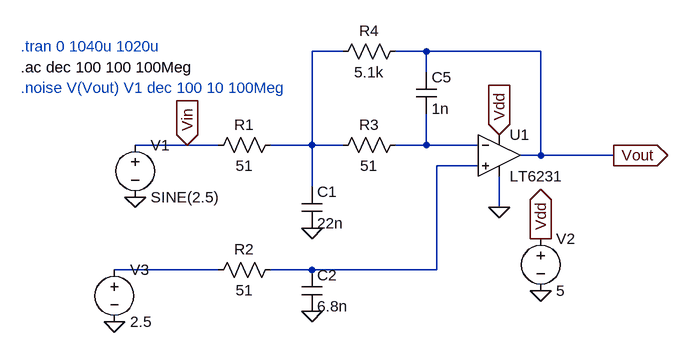
[diagram p0: schematic Multiple feedback low pass amplifier.asc]
Multiple feedback low pass amplifier.asc, the LTspice schematic file:
Version 4
SHEET 1 880 752
WIRE 272 80 224 80
WIRE 400 80 352 80
WIRE 576 80 400 80
WIRE 400 112 400 80
WIRE 32 224 -48 224
WIRE 80 224 32 224
WIRE 224 224 224 80
WIRE 224 224 160 224
WIRE 272 224 224 224
WIRE 400 224 400 176
WIRE 400 224 352 224
WIRE 480 224 400 224
WIRE 576 240 576 80
WIRE 576 240 544 240
WIRE 688 240 576 240
WIRE 480 256 416 256
WIRE 224 288 224 224
WIRE 512 320 512 272
WIRE 80 416 -80 416
WIRE 224 416 160 416
WIRE 416 416 416 256
WIRE 416 416 224 416
FLAG 688 240 Vout
IOPIN 688 240 Out
FLAG 512 208 Vdd
IOPIN 512 208 In
FLAG 512 320 0
FLAG 224 352 0
FLAG 576 448 0
FLAG 576 368 Vdd
IOPIN 576 368 Out
FLAG 224 480 0
FLAG -80 496 0
FLAG -48 304 0
FLAG 32 224 Vin
IOPIN 32 224 In
SYMBOL res 176 208 R90
WINDOW 0 0 56 VBottom 2
WINDOW 3 32 56 VTop 2
SYMATTR InstName R1
SYMATTR Value 51
SYMBOL cap 208 288 R0
SYMATTR InstName C1
SYMATTR Value 22n
SYMBOL LT6231 512 240 R0
SYMATTR InstName U1
SYMBOL cap 384 112 R0
SYMATTR InstName C5
SYMATTR Value 1n
SYMBOL res 368 208 R90
WINDOW 0 0 56 VBottom 2
WINDOW 3 32 56 VTop 2
SYMATTR InstName R3
SYMATTR Value 51
SYMBOL res 368 64 R90
WINDOW 0 0 56 VBottom 2
WINDOW 3 32 56 VTop 2
SYMATTR InstName R4
SYMATTR Value 5.1k
SYMBOL voltage 576 352 R0
WINDOW 123 0 0 Left 0
WINDOW 39 0 0 Left 0
SYMATTR InstName V2
SYMATTR Value 5
SYMBOL res 176 400 R90
WINDOW 0 0 56 VBottom 2
WINDOW 3 32 56 VTop 2
SYMATTR InstName R2
SYMATTR Value 51
SYMBOL cap 208 416 R0
SYMATTR InstName C2
SYMATTR Value 6.8n
SYMBOL voltage -48 208 R0
SYMATTR InstName V1
SYMATTR Value SINE(2.5)
SYMATTR Value2 AC 1 0
SYMATTR SpiceLine Rser=50
SYMBOL voltage -80 400 R0
SYMATTR InstName V3
SYMATTR Value 2.5
SYMATTR SpiceLine Rser=50
TEXT -224 72 Left 2 ;.tran 0 1040u 1020u
TEXT -224 104 Left 2 !.ac dec 100 100 100Meg
TEXT -224 136 Left 2 ;.noise V(Vout) V1 dec 100 10 100Meg

The netlist it stands for:
* Multiple feedback low pass amplifier.asc
R1 N001 Vin 51
C1 N001 0 22n
XU1 N003 N002 Vout Vdd 0 LT6231  ; pins In+ In- OUT V+ V-
C5 Vout N002 1n
R3 N002 N001 51
R4 Vout N001 5.1k
V2 Vdd 0 5
R2 N003 N004 51
C2 N003 0 6.8n
V1 Vin 0 SINE(2.5) AC 1 0 Rser=50
V3 N004 0 2.5 Rser=50
* .tran 0 1040u 1020u
.ac dec 100 100 100Meg
* .noise V(Vout) V1 dec 100 10 100Meg
.lib LTC2.lib
.backanno
.end